# Altium schematic sheet Deck.SchDoc: TOF_Deck
size A4; Author: Iman Ostovar; CompanyName: ETH Zürich; DrawnBy: Iman Ostovar; Engineer: Iman Ostovar; Organization: PBL; DocumentNumber: Master Project; Revision: A; SheetNumber: 1; SheetTotal: 1
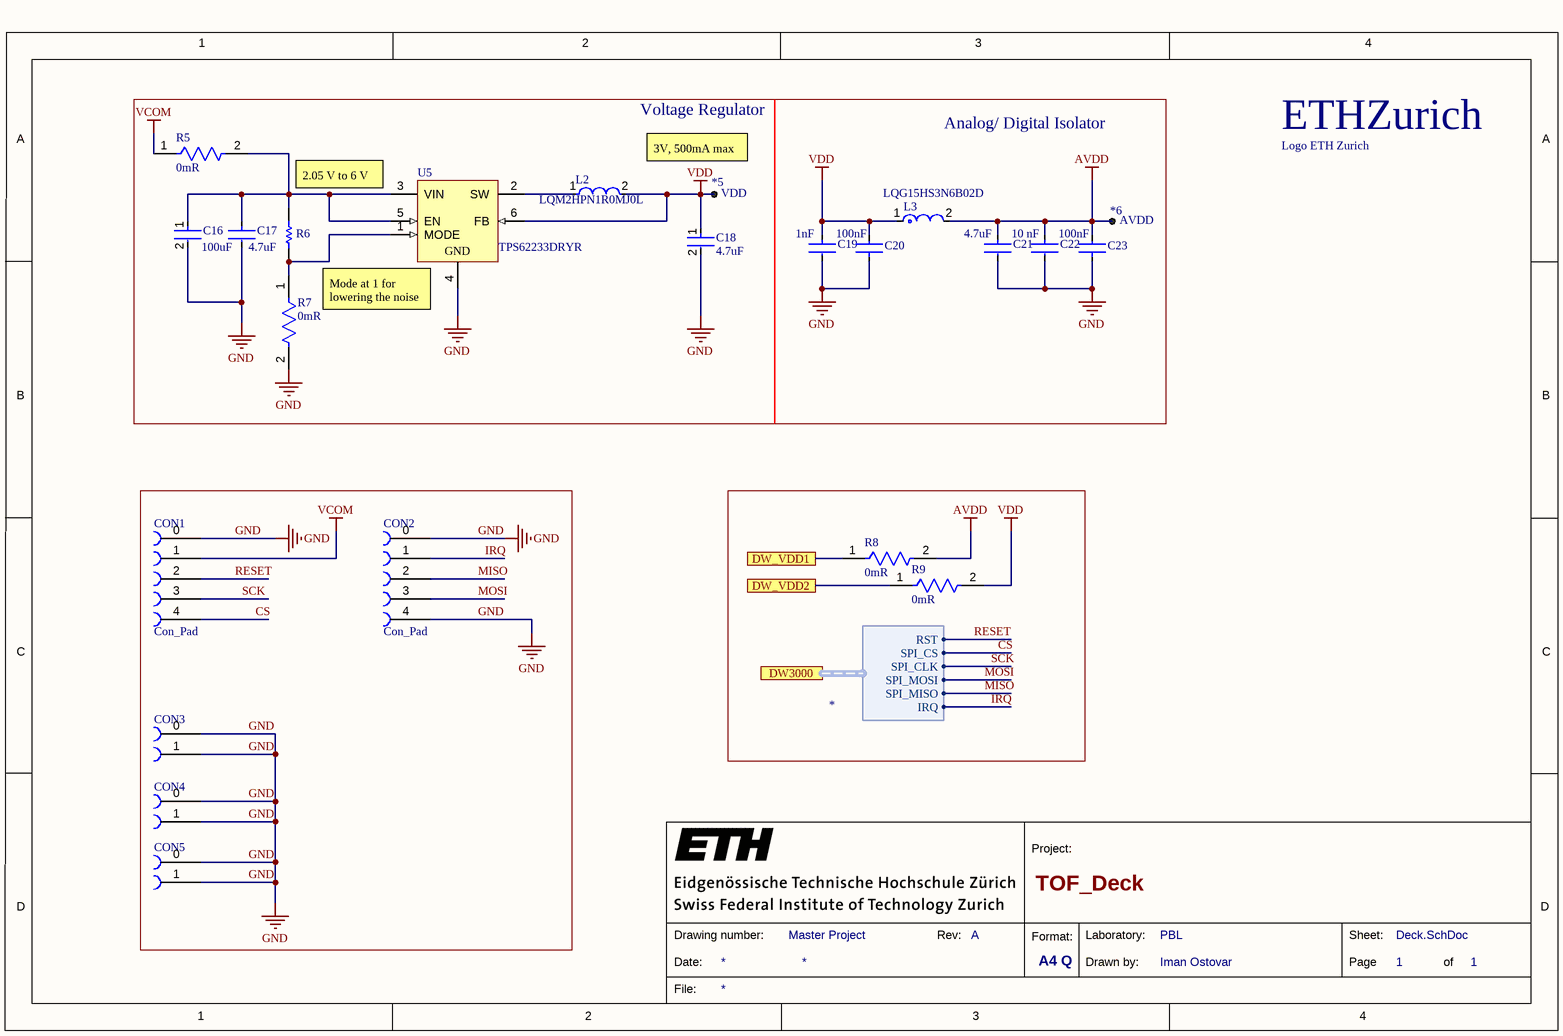
[diagram p0: Deck.SchDoc]

## Parts
*5  VDD  [Pad-1mm]  (no BOM)
*6  AVDD  [Pad-1mm]  (no BOM)
A1  Logo ETH Zurich  [eth-zurich_3mm]  (no BOM)
C16  Capacitance: 100uF  [FP-GRM21B-0_2-e0_2_0_7-IPC_A]  (hidden comment: GRM21BR60J107ME15L)
C17  Capacitance: 4.7uF  [FP-GRM155-0_1-IPC_B]  (hidden comment: GRM155R60J475ME47D)
C18  Capacitance: 4.7uF  [FP-GRM155-0_1-IPC_B]  (hidden comment: GRM155R60J475ME47D)
C19  Capacitance: 1nF  [FP-GRM155-0_05-IPC_B]  (hidden comment: GRM1555C1H102JA01D)
C20  Capacitance: 100nF  [FP-GRM155-0_05-IPC_B]  (hidden comment: GRM155R71E104ME14D)
C21  Capacitance: 4.7uF  [FP-GRM155-0_1-IPC_B]  (hidden comment: GRM155R60J475ME47D)
C22  Capacitance: 10 nF  [FP-CC0402-MFG]  (hidden comment: CC0402KRX7R7BB103)
C23  Capacitance: 100nF  [FP-GRM155-0_05-IPC_B]  (hidden comment: GRM155R71E104ME14D)
CON1  Con_Pad  [Cons_Pad]
CON2  Con_Pad  [Cons_Pad]
CON3  Con_Pad_GND  [PCBComponent_1]  (value not drawn)
CON4  Con_Pad_GND  [PCBComponent_1]  (value not drawn)
CON5  Con_Pad_GND  [PCBComponent_1]  (value not drawn)
L2  LQM2HPN1R0MJ0L  [FP-LQM2HPN_J0-IPC_B]
L3  LQG15HS3N6B02D  [FP-LQG15HH_02-IPC_A]
R5  Resistance: 0mR  [FP-CRCW0402-e3-IPC_C]  (hidden comment: CRCW04020000Z0ED)
R6  CPF0402B47K5E1  [RESC1005X35X20LL05T10]  (value not drawn)
R7  Resistance: 0mR  [FP-CRCW0402-e3-IPC_C]  (hidden comment: CRCW04020000Z0ED)
R8  Resistance: 0mR  [FP-CRCW0402-e3-IPC_C]  (hidden comment: CRCW04020000Z0ED)
R9  Resistance: 0mR  [FP-CRCW0402-e3-IPC_C]  (hidden comment: CRCW04020000Z0ED)
U5  TPS62233DRYR  [DRY0006A]

## Ports
DW3000 (harness *), DW_VDD1, DW_VDD2

## Harnesses
*: SPI_CS, SPI_CLK, SPI_MOSI, SPI_MISO, RST, IRQ

## Nets
AVDD: *6.1 C21.1 C22.1 C23.2 L3.2 R8.2
GND: C16.2 C17.2 C18.2 C19.2 C20.1 C21.2 C22.2 C23.1 CON1.0 CON2.0 CON2.4 CON3.0 CON3.1 CON4.0 CON4.1 CON5.0 CON5.1 R7.2 U5.4(GND)
VCOM: CON1.1 R5.1
VDD: *5.1 C18.1 C19.1 C20.2 L2.2 L3.1 R9.2 U5.6(FB)
CS: CON1.4 ; port DW3000.SPI_CS
DW_VDD1: R8.1 ; port DW_VDD1
DW_VDD2: R9.1 ; port DW_VDD2
IRQ: CON2.1 ; port DW3000.IRQ
MISO: CON2.2 ; port DW3000.SPI_MISO
MOSI: CON2.3 ; port DW3000.SPI_MOSI
RESET: CON1.2 ; port DW3000.RST
SCK: CON1.3 ; port DW3000.SPI_CLK
NetC16_1: C16.1 C17.1 R5.2 R6.2 U5.3(VIN) U5.5(EN)
NetL2_1: L2.1 U5.2(SW)
NetR6_1: R6.1 R7.1 U5.1(MODE)

## Notes on the sheet
- Voltage Regulator
- 3V, 500mA max
- Analog/ Digital Isolator
- 2.05 V to 6 V
- (near U5) Mode at 1 for lowering the noise
- 1
- 2
- 3
- 4
- A
- B
- C
- Project:
- D
- Date:
- Drawing number:
- Rev:
- Format:
- A4 Q
- Drawn by:
- Laboratory:
- Page
- Sheet:
- of
- File:
- (in symbol CMP-00038-1) ETHZurich

## Library data of the parts
*5 *6 = CMP-01283-1: 1mm SMT Test Pad; Mounting Technology: SMT
A1 = CMP-00038-1
C16 = CMP-2000-07599-2: Chip Multilayer Ceramic Capacitors for General Purpose, 0805, 100uF, X5R, 15%, 20%, 6.3V; Length: 0.079inch; Dielectric: X5R; Case Code (Metric): 2012; Max Operating Temperature: 85°C; Voltage Rating (DC): 6.3V; Min Operating Temperature: -55°C; Tolerance: 20%; Packaging: Cut Tape; Voltage Rating: 6.3V; REACH SVHC: No SVHC; Width: 0.049inch; Mount: Surface Mount; Case/Package: 0805; Case Code (Imperial): 0805; Lead Free: Lead Free; Thickness: 0.057inch
C17 C18 C21 = CMP-2008-04549-2: Chip Multilayer Ceramic Capacitors for General Purpose, 0402, 4.7uF, X5R, 15%, 20%, 6.3V; Height: 0.5mm; Weight: 0.000212oz; Length: 1mm; Case Code (Metric): 1005; Packaging: Tape and Reel; Termination: SMD/SMT; Dielectric: X5R; Depth: 0.5mm; Case Code (Imperial): 0402; Min Operating Temperature: -55°C; Case/Package: 0402; Voltage: 6.3V; Width: 0.02inch; Lead Free: Lead Free; Thickness: 0.022inch; Contact Plating: Tin; REACH SVHC: No SVHC; Package Quantity: 10000; Tolerance: 20%; Voltage Rating (DC): 6.3V; Voltage Rating: 6.3V; Mount: Surface Mount; Max Operating Temperature: 85°C
C19 = CMP-2008-04254-2: Chip Multilayer Ceramic Capacitors for General Purpose, 0402, 1000pF, C0G, 30ppm/°C, 5%, 50V; Insulation Resistance: 10GR; Packaging: Tape and Reel; Lead Free: Lead Free; Tolerance: 5%; Temperature Coefficient: 30ppm/°C; Thickness: 0.022inch; Termination: SMD/SMT; Max Operating Temperature: 125°C; Height: 0.5mm; Package Quantity: 1; Radiation Hardening: No; Material: Ceramic; Case Code (Metric): 1005; Number of Pins: 2; Voltage Rating: 50V; Mount: Surface Mount; Voltage: 50V; Case/Package: 0402; Min Operating Temperature: -55°C; Dielectric Material: Ceramic; Width: 0.5mm; Depth: 0.5mm; Case Code (Imperial): 0402; REACH SVHC: No SVHC; Dielectric: C0G; Voltage Rating (DC): 50V; Length: 1mm
C20 C23 = CMP-06035-053616-1: Chip Multilayer Ceramic Capacitors for General Purpose, 0402, 0.10uF, X7R, 15%, 20%, 25V; Dielectric: X7R; Width: 0.5mm; Case/Package: 0402; Package Quantity: 10000; Lead Free: Lead Free; Voltage Rating (DC): 25V; Max Operating Temperature: 125°C; Depth: 0.5mm; Packaging: Tape and Reel; Length: 1mm; Case Code (Metric): 1005; Tolerance: 20%; Case Code (Imperial): 0402; Thickness: 0.022inch; Material: Ceramic; Voltage Rating: 25V; Weight: 0.000212oz; Min Operating Temperature: -55°C; Termination: SMD/SMT; Mount: Surface Mount; Resistor Type: Ceramic; Height: 0.5mm
C22 = CMP-03422-000501-1: CAP CER 10000PF 16V X7R 0402; Manufacturer: YAGEO; Automotive Grade: NA; Material: Ceramic; Value: 10 nF; Tolerance: 0.1; Temperature Coefficient: 30ppm/°C; Temperature Range Low: -55°C; Temperature Range High: +125°C; Mouser Description: 0402 10 nF 16 V ±10 % Tolerance X7R SMT Multilayer Ceramic Capacitor; Footprint Url: http://www.yageo.com/exep/pages/download/literatures/UPY-C_GEN_24.pdf; Category: Cap; RoHS: TRUE; Manufacturer Part Number: CC0402KRX7R7BB103; ComponentLink2Description: Datasheet; Ipc Land Pattern Name: CAPC10050X50; Automotive: No; ComponentLink2URL: http://www.yageo.com/documents/recent/UPY-GP_NP0_16V-to-50V_16.pdf; Device Class L1: Passive Components; Height: 0.55mm; Temperature Characteristic: X7R; Package: CC0402; Voltage Rating: 16 V; Device Class L3: Ceramic Capacitors; Lead Free: Yes; Device Class L2: Capacitors; Digikey Description: CAP CER 10000PF 16V X7R 0402; Octopart: https://octopart.com/cc0402krx7r7bb103-yageo-192895; Temperature: -55°C to +125°C
L2 = CMP-1662-00025-2: FIXED IND 1UH 1.5A 90 MOHM SMD; Shielding: Shielded; Self Resonant Frequency: 70MHz; Tolerance: 20%; DC Resistance (DCR): 3.5R; Current: 150mA; Core Material: Ferrite; Test Frequency: 1MHz; Inductance: 1uH; Package Quantity: 3000; Military Standard: Not; Height: 1.1mm; Min Operating Temperature: -40°C; RoHS Compliant: Yes; Case/Package: 1008; Depth: 2.2mm; Mount: Surface Mount; REACH SVHC: No SVHC; Max DC Current: 1.5A; Max Operating Temperature: 125°C; Case Code (Metric): 2520; Series: LQM2HP_J0; Inductance Tolerance: 20%; Length: 2.5mm; DC Current: 1.5A; Radiation Hardening: No; Lead Free: Lead Free; Case Code (Imperial): 1008; Width: 2mm; Current Rating: 1.5A; Packaging: Tape and Reel; Termination: SMD/SMT
L3 = CMP-06042-005542-1: Multilayer type RF Inductor 3.6nH ±0.1nH 0.14Ω 750mA 0402
R5 R7-R9 = CMP-2002-08122-2: RES Thick Film, 0Ω, 0.063W, 0402; Tolerance: 5%; Max Power Dissipation: 63mW; Voltage Rating: 50V; Temperature Coefficient: 100ppm/°C; Contact Plating: Tin; Height: 0.35mm; Radiation Hardening: No; Features: Automotive AEC-Q200; Composition: Thick Film; Width: 0.5mm; Weight: 2.3E-05oz; Termination: SMD/SMT; Packaging: Tape and Reel; Mount: Surface Mount; Case Code (Metric): 1005; Military Standard: Not; Min Operating Temperature: -55°C; Number of Terminations: 2; Package Quantity: 1; Case Code (Imperial): 0402; Depth: 0.5mm; Max Operating Temperature: 155°C; Case/Package: 0402; Power Rating: 63mW; Lead Free: Lead Free; Voltage Rating (DC): 50V; Length: 1mm
R6 = CMP-2002-03309-1: 47.5k, CPF0402B47K5E1; Manufacturer: TE Connectivity / AMP; Part Number: CPF0402B47K5E1
U5 = CMP-0323-00281-3: Buck Step Down Regulator with 2.05 to 6 V Input and 3 V Output, -40 to 85 degC, 6-Pin SON (DRY), Green (RoHS & no Sb/Br); Manufacturer: Texas Instruments; Vin(Max)(V): 6; Synchronous Rectification: False; Regulated Outputs(#): 1; SubFamily: Step-Down Regulator; Rating: Catalog; Preset Vout(V): 3; Vin(Min)(V): 2.05; Iq(Typ)(mA): 0.022; Duty Cycle(Max)(%): 100; Switch Current Limit(Typ)(A): 0.84; Iout(Max)(A): 0.5; ComponentLink1URL: http://www.ti.com/general/docs/lit/getliterature.tsp?genericPartNumber=TPS62233&fileType=pdf; Eco-Plan: Green (RoHS & no Sb/Br); ComponentLink1Description: Datasheet; PackageDescription: 6-Pin Plastic Small Outline No-Lead, 1 x 1.45 x 0.6 mm Body, 0.5 mm Pitch; PartNumber: TPS62233DRYR; Topology: Buck; Vout(Min)(V): 3; ComponentLink2Description: Package Specification; DatasheetVersion: SLVS941E; ComponentLink3URL: Samples URL:http://www.ti.com/product/tps62233#samples; Vout(Max)(V): 3; ComponentLink2URL: http://www.ti.com/litv/pdf/mpds221e; PackageVersion: revF, Dec-2011; ComponentLink3Description: URL Link1; PackageReference: DRY0006A; Mounting Technology: Surface Mount